# Altium project LPCB228__RLOOP__DC_CONVERTER.PrjPCB
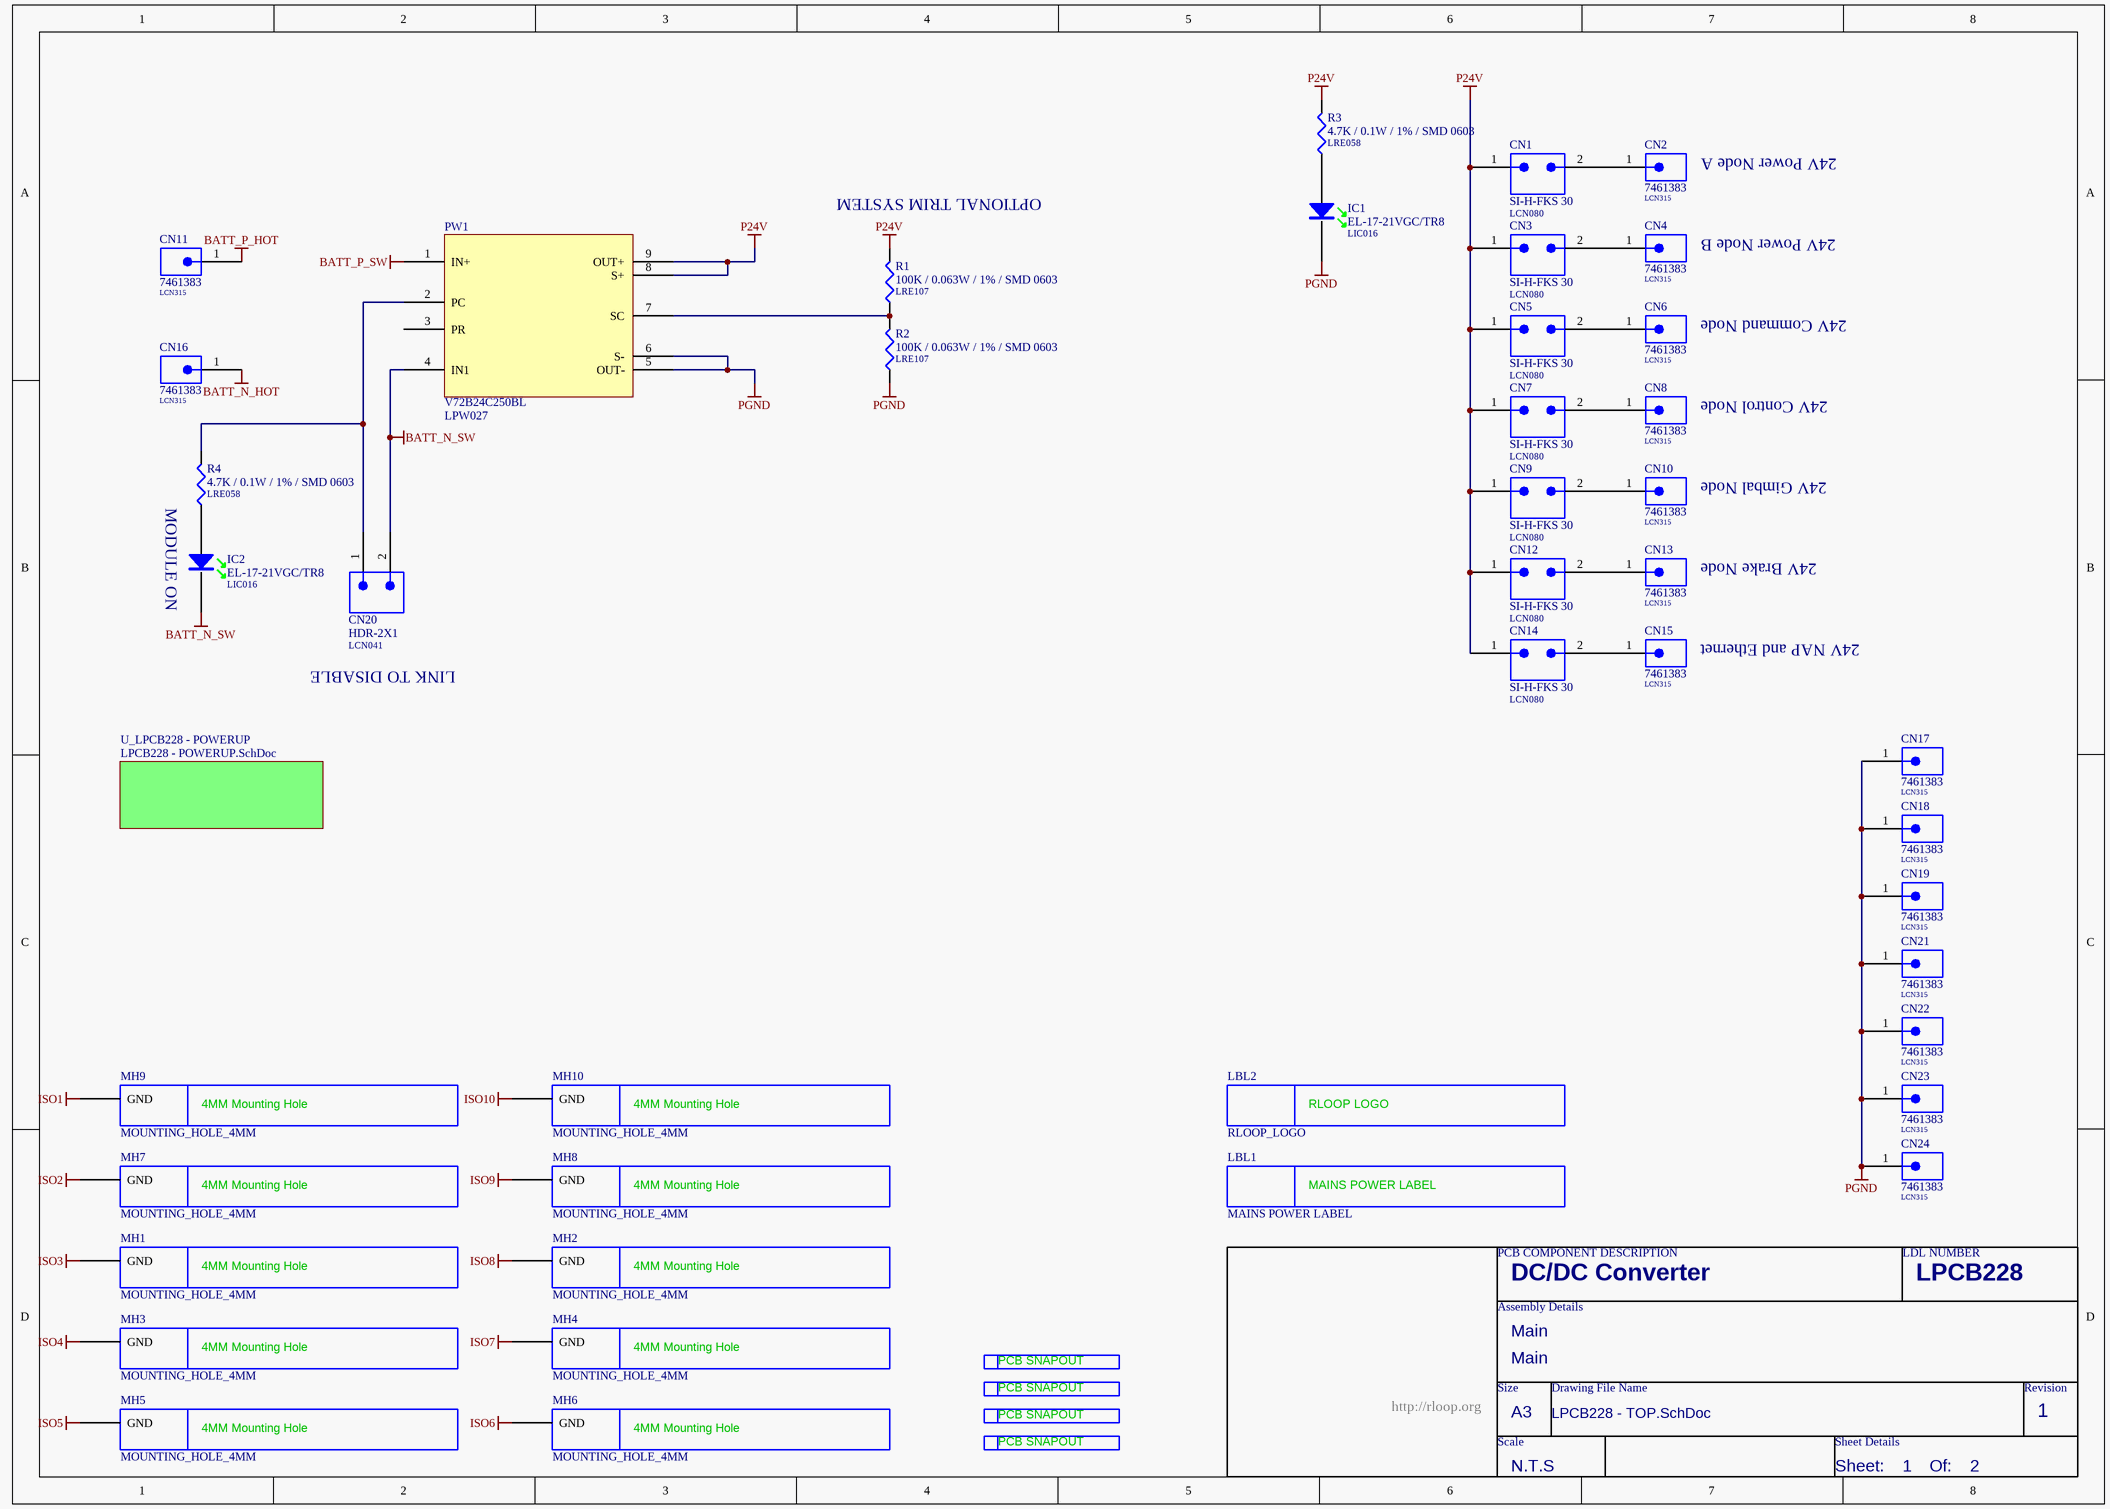
[diagram p0: LPCB228 - TOP.SchDoc]
2 sheets, 61 parts. Net scope: global (net labels, ports and power ports of the same name join across sheets).
Board files: LPCB228R0.PcbDoc, LPCB228R0__ASCII.PcbDoc
Sheets:
  LPCB228 - TOP.SchDoc
    U_LPCB228 - POWERUP = LPCB228 - POWERUP.SchDoc

## Sheet LPCB228 - TOP.SchDoc
size A3; Address1: Factory 10; Address2: 9-13 Dingley Avenue, Dandeong, VICTORIA 3175, AUSTRALIA; DocumentNumber: 1; Revision: 1; SheetNumber: 1; SheetTotal: 2; Lockie__PCB_SUB_ASSEMBLY: Main; Lockie__PCB_ASSEMBLY: Main; Lockie__LDL: LPCB228; Lockie__PCB_DESCRIPTION: DC/DC Converter

### Parts
CN1  SI-H-FKS 30  LDL_NUMBER: LCN080  [SI-H-FKS-30]
CN2  7461383  LDL_NUMBER: LCN315  [7461383]
CN3  SI-H-FKS 30  LDL_NUMBER: LCN080  [SI-H-FKS-30]
CN4  7461383  LDL_NUMBER: LCN315  [7461383]
CN5  SI-H-FKS 30  LDL_NUMBER: LCN080  [SI-H-FKS-30]
CN6  7461383  LDL_NUMBER: LCN315  [7461383]
CN7  SI-H-FKS 30  LDL_NUMBER: LCN080  [SI-H-FKS-30]
CN8  7461383  LDL_NUMBER: LCN315  [7461383]
CN9  SI-H-FKS 30  LDL_NUMBER: LCN080  [SI-H-FKS-30]
CN10  7461383  LDL_NUMBER: LCN315  [7461383]
CN11  7461383  LDL_NUMBER: LCN315  [7461383]
CN12  SI-H-FKS 30  LDL_NUMBER: LCN080  [SI-H-FKS-30]
CN13  7461383  LDL_NUMBER: LCN315  [7461383]
CN14  SI-H-FKS 30  LDL_NUMBER: LCN080  [SI-H-FKS-30]
CN15  7461383  LDL_NUMBER: LCN315  [7461383]
CN16  7461383  LDL_NUMBER: LCN315  [7461383]
CN17  7461383  LDL_NUMBER: LCN315  [7461383]
CN18  7461383  LDL_NUMBER: LCN315  [7461383]
CN19  7461383  LDL_NUMBER: LCN315  [7461383]
CN20  HDR-2X1  LDL_NUMBER: LCN041  [HDR-2X1]
CN21  7461383  LDL_NUMBER: LCN315  [7461383]
CN22  7461383  LDL_NUMBER: LCN315  [7461383]
CN23  7461383  LDL_NUMBER: LCN315  [7461383]
CN24  7461383  LDL_NUMBER: LCN315  [7461383]
IC1  EL-17-21VGC/TR8  LDL_NUMBER: LIC016  [CR2012-0805-LED]
IC2  EL-17-21VGC/TR8  LDL_NUMBER: LIC016  [CR2012-0805-LED]
LBL1  MAINS POWER LABEL  [MAINS POWER LABEL]  (no BOM)
LBL2  RLOOP_LOGO  [RLOOP_LOGO]  (no BOM)
MH1  MOUNTING_HOLE_4MM  [MOUNTING_HOLE_4MM]  (no BOM)
MH2  MOUNTING_HOLE_4MM  [MOUNTING_HOLE_4MM]  (no BOM)
MH3  MOUNTING_HOLE_4MM  [MOUNTING_HOLE_4MM]  (no BOM)
MH4  MOUNTING_HOLE_4MM  [MOUNTING_HOLE_4MM]  (no BOM)
MH5  MOUNTING_HOLE_4MM  [MOUNTING_HOLE_4MM]  (no BOM)
MH6  MOUNTING_HOLE_4MM  [MOUNTING_HOLE_4MM]  (no BOM)
MH7  MOUNTING_HOLE_4MM  [MOUNTING_HOLE_4MM]  (no BOM)
MH8  MOUNTING_HOLE_4MM  [MOUNTING_HOLE_4MM]  (no BOM)
MH9  MOUNTING_HOLE_4MM  [MOUNTING_HOLE_4MM]  (no BOM)
MH10  MOUNTING_HOLE_4MM  [MOUNTING_HOLE_4MM]  (no BOM)
PW1  V72B24C250BL  LDL_NUMBER: LPW027  [FASTRAK_MINI_ONBOARD_MOUNT]
R1  100K / 0.063W / 1% / SMD 0603  LDL_NUMBER: LRE107  [LFP020__CR1608-0603-IPC7351_B]
R2  100K / 0.063W / 1% / SMD 0603  LDL_NUMBER: LRE107  [LFP020__CR1608-0603-IPC7351_B]
R3  4.7K / 0.1W / 1% / SMD 0603  LDL_NUMBER: LRE058  [LFP020__CR1608-0603-IPC7351_B]
R4  4.7K / 0.1W / 1% / SMD 0603  LDL_NUMBER: LRE058  [LFP020__CR1608-0603-IPC7351_B]
SN1  PCB_SNAPOUT  [SNAPOUT_NEW]  (value not drawn)  (no BOM)
SN2  PCB_SNAPOUT  [SNAPOUT_NEW]  (value not drawn)  (no BOM)
SN3  PCB_SNAPOUT  [SNAPOUT_NEW]  (value not drawn)  (no BOM)
SN4  PCB_SNAPOUT  [SNAPOUT_NEW]  (value not drawn)  (no BOM)

### Sub-sheets
U_LPCB228 - POWERUP = LPCB228 - POWERUP.SchDoc: no entries

### Nets
BATT_N_HOT: CN16.1
BATT_N_SW: CN20.2 IC2.K PW1.4(IN1)
BATT_P_HOT: CN11.1
BATT_P_SW: PW1.1(IN+)
ISO1: MH9.MOUNT(GND)
ISO2: MH7.MOUNT(GND)
ISO3: MH1.MOUNT(GND)
ISO4: MH3.MOUNT(GND)
ISO5: MH5.MOUNT(GND)
ISO6: MH6.MOUNT(GND)
ISO7: MH4.MOUNT(GND)
ISO8: MH2.MOUNT(GND)
ISO9: MH8.MOUNT(GND)
ISO10: MH10.MOUNT(GND)
P24V: CN1.1 CN3.1 CN5.1 CN7.1 CN9.1 CN12.1 CN14.1 PW1.8(S+) PW1.9(OUT+) R1.2 R3.2
PGND: CN17.1 CN18.1 CN19.1 CN21.1 CN22.1 CN23.1 CN24.1 IC1.K PW1.5(OUT-) PW1.6(S-) R2.1
NetCN1_2: CN1.2 CN2.1
NetCN3_2: CN3.2 CN4.1
NetCN5_2: CN5.2 CN6.1
NetCN7_2: CN7.2 CN8.1
NetCN9_2: CN9.2 CN10.1
NetCN12_2: CN12.2 CN13.1
NetCN14_2: CN14.2 CN15.1
NetCN20_1: CN20.1 PW1.2(PC) R4.2
NetIC1_A: IC1.A R3.1
NetIC2_A: IC2.A R4.1
NetPW1_7: PW1.7(SC) R1.1 R2.2

Not connected (* = marked no-connect by the designer): PW1 3(PR)

### Notes on the sheet
- 24V Power Node A
- (near R1) OPTIONAL TRIM SYSTEM
- 24V Power Node B
- 24V Command Node
- 24V Control Node
- 24V Gimbal Node
- 24V Brake Node
- (near IC2) MODULE ON
- 24V NAP and Ethernet
- LINK TO DISABLE
- PCB COMPONENT DESCRIPTION
- LDL NUMBER
- Assembly Details
- Size
- Drawing File Name
- Revision
- http://rloop.org
- Scale
- A3
- Sheet Details
- N.T.S
- Sheet:
- Of:
- (in symbol MOUNTING_HOLE_4MM) 4MM Mounting Hole
- (in symbol PCB_SNAPOUT) PCB SNAPOUT
- (in symbol RLOOP_LOGO) RLOOP LOGO

### Library data of the parts
CN1 CN3 CN5 CN7 CN9 CN12 CN14 = SI-H-FKS 30: Connector, Blade Fuse Holder, 5mm Terminals, 30A Max, PTH; FMEDA__CHANNEL: COM; FMEDA__OPERATING__CURRENT_MAX: 0; FMEDA__OPERATING__TEMP_MAX: 50; FMEDA__OPERATING__TEMP_MIN: -20; FMEDA__OPERATING__TEMP_TYP: 27; FMEDA__OPERATING__VOLTAGE_MAX: 16; FMEDA__OPERATING__VOLTAGE_TYP: 12; FMEDA__FUNCTION_IN_SYSTEM: *; FMEDA__OPERATING__CURRENT_MIN: 0; FMEDA__OPERATING__CURRENT_TYP: 0; FMEDA__OPERATING__VOLTAGE_MIN: 0
CN2 CN4 CN6 CN8 CN10 CN11 CN13 CN15-CN19 CN21-CN24 = 7461383: Terminal, Bush with M5 Shank; FMEDA__CHANNEL: COM; FMEDA__OPERATING__CURRENT_MAX: 0; FMEDA__OPERATING__TEMP_MAX: 50; FMEDA__OPERATING__TEMP_MIN: -20; FMEDA__OPERATING__TEMP_TYP: 27; FMEDA__OPERATING__VOLTAGE_MAX: 16; FMEDA__OPERATING__VOLTAGE_TYP: 12; FMEDA__OPERATING__CURRENT_MIN: 0; FMEDA__OPERATING__CURRENT_TYP: 0; FMEDA__OPERATING__VOLTAGE_MIN: 0
CN20 = HDR-2X1: Header, 2.54mm (0.1in), 2 Pins x 1 Row (40 Per Row In Strip); FMEDA__CHANNEL: COM; FMEDA__OPERATING__CURRENT_MAX: 0; FMEDA__OPERATING__TEMP_MAX: 50; FMEDA__OPERATING__TEMP_MIN: -20; FMEDA__OPERATING__TEMP_TYP: 27; FMEDA__OPERATING__VOLTAGE_MAX: 16; FMEDA__OPERATING__VOLTAGE_TYP: 12; FMEDA__OPERATING__CURRENT_MIN: 0; FMEDA__OPERATING__CURRENT_TYP: 0; FMEDA__OPERATING__VOLTAGE_MIN: 0; FMEDA__FUNCTION_IN_SYSTEM: *
IC1 IC2 = EL-17-21VGC/TR8: LED, SMD, 0805 Green [LIC016]; FMEDA__OPERATING__TEMP_MAX: 50; FMEDA__OPERATING__TEMP_MIN: -20; FMEDA__OPERATING__TEMP_TYP: 27; FMEDA__CHANNEL: COM; FMEDA__FUNCTION_IN_SYSTEM: *
LBL1 = MAINS POWER LABEL: FMEDA__CHANNEL: DIAG; FMEDA__FUNCTION_IN_SYSTEM: *
LBL2 = RLOOP_LOGO: FMEDA__CHANNEL: DIAG; FMEDA__FUNCTION_IN_SYSTEM: *
MH1-MH10 = MOUNTING_HOLE_4MM: 4MM Mouting Hole; FMEDA__CHANNEL: DIAG; FMEDA__FUNCTION_IN_SYSTEM: *
PW1 = V72B24C250BL: DC-DC Converter, 43-110VIN, 24V, 10A
R1 R2 = 100K / 0.063W / 1% / SMD 0603: Resistor, Ceramic Chip, 100K0, 0.063W, 1%, SMD 0603 [LRE107]; FMEDA__OPERATING__POWER_MAX: 0; FMEDA__OPERATING__TEMP_MAX: 50; FMEDA__OPERATING__TEMP_MIN: -20; FMEDA__OPERATING__TEMP_TYP: 27; FMEDA__CHANNEL: COM; Value: 100K; FMEDA__OPERATING__POWER_MIN: 0; FMEDA__OPERATING__VOLTAGE_MAX: 0; FMEDA__OPERATING__VOLTAGE_MIN: 0; FMEDA__OPERATING__VOLTAGE_TYP: 0; FMEDA__FUNCTION_IN_SYSTEM: *
R3 R4 = 4.7K / 0.1W / 1% / SMD 0603: Resistor, Ceramic Chip, 4K7, 0.1W, 1%, SMD 0603 [LRE058]; FMEDA__OPERATING__POWER_MAX: 0; FMEDA__OPERATING__TEMP_MAX: 50; FMEDA__OPERATING__TEMP_MIN: -20; FMEDA__OPERATING__TEMP_TYP: 27; FMEDA__CHANNEL: COM; VALUE: 4.7K; FMEDA__OPERATING__POWER_MIN: 0; FMEDA__OPERATING__VOLTAGE_MAX: 0; FMEDA__OPERATING__VOLTAGE_MIN: 0; FMEDA__OPERATING__VOLTAGE_TYP: 0; FMEDA__FUNCTION_IN_SYSTEM: *
SN1-SN4 = PCB_SNAPOUT: FMEDA__CHANNEL: DIAG; FMEDA__FUNCTION_IN_SYSTEM: *

## Sheet LPCB228 - POWERUP.SchDoc
size A3; Address1: Factory 10; Address2: 9-13 Dingley Avenue, Dandeong, VICTORIA 3175, AUSTRALIA; DocumentNumber: 2; Revision: 1; SheetNumber: 2; SheetTotal: 2; Lockie__PCB_SUB_ASSEMBLY: Power / Ignitor; Lockie__PCB_ASSEMBLY: Main; Lockie__LDL: LPCB228; Lockie__PCB_DESCRIPTION: DC/DC Converter
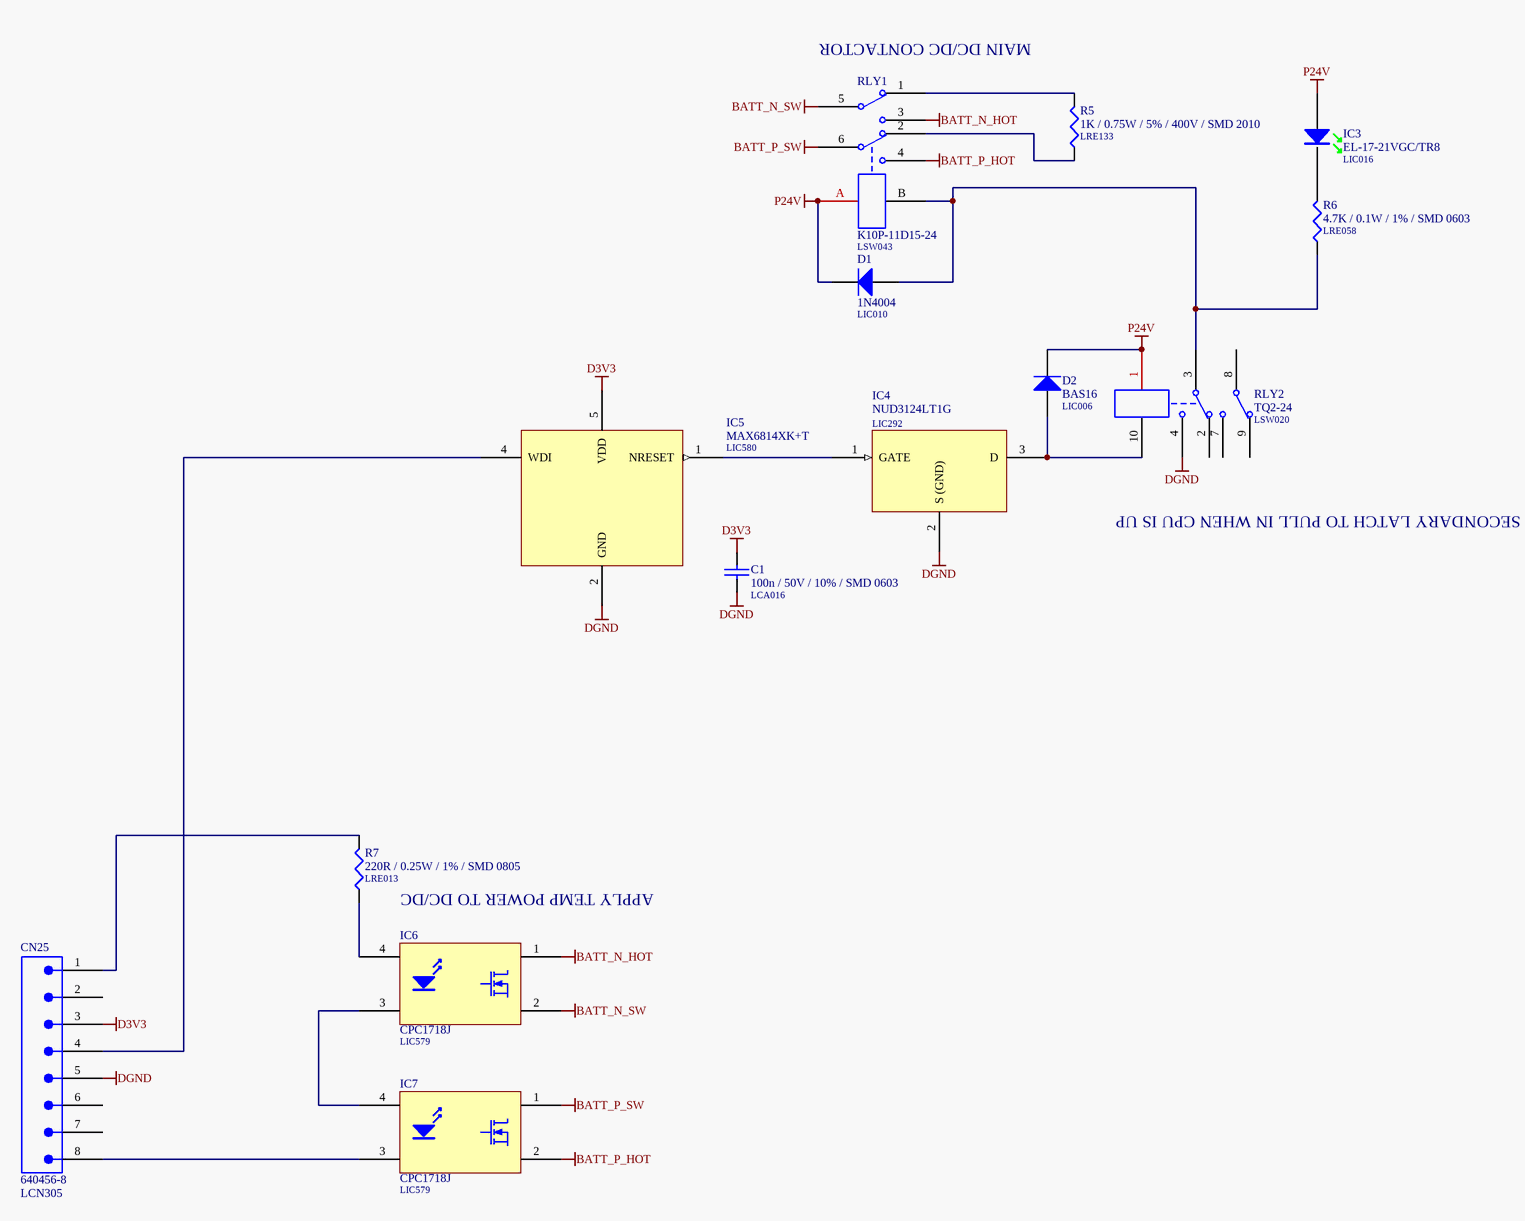
[diagram p1: LPCB228 - POWERUP.SchDoc]

### Parts
C1  100n / 50V / 10% / SMD 0603  LDL_NUMBER: LCA016  [LFP011__CC1608-0603-IPC7351_B]
CN25  640456-8  LDL_NUMBER: LCN305  [640456-8]
D1  1N4004  LDL_NUMBER: LIC010  [DO-41]
D2  BAS16  LDL_NUMBER: LIC006  [LFP021__SOT23]
IC3  EL-17-21VGC/TR8  LDL_NUMBER: LIC016  [CR2012-0805-LED]
IC4  NUD3124LT1G  LDL_NUMBER: LIC292  [LFP021__SOT23]
IC5  MAX6814XK+T  LDL_NUMBER: LIC580  [LFP047__SOT353]
IC6  CPC1718J  LDL_NUMBER: LIC579  [ISOPLUS-264]
IC7  CPC1718J  LDL_NUMBER: LIC579  [ISOPLUS-264]
R5  1K / 0.75W / 5% / 400V / SMD 2010  LDL_NUMBER: LRE133  [LFP060__CR5025-2010]
R6  4.7K / 0.1W / 1% / SMD 0603  LDL_NUMBER: LRE058  [LFP020__CR1608-0603-IPC7351_B]
R7  220R / 0.25W / 1% / SMD 0805  LDL_NUMBER: LRE013  [LFP029__CR2012-0805]
RLY1  K10P-11D15-24  LDL_NUMBER: LSW043  [K10P-11D15-24]
RLY2  TQ2-24  LDL_NUMBER: LSW020  [TQ2]

### Nets
BATT_N_HOT: IC6.1 RLY1.3
BATT_N_SW: IC6.2 RLY1.5
BATT_P_HOT: IC7.2 RLY1.4
BATT_P_SW: IC7.1 RLY1.6
D3V3: C1.1 CN25.3 IC5.5(VDD)
DGND: C1.2 CN25.5 IC4.2(S_(GND)) IC5.2(GND) RLY2.4
P24V: D1.K D2.3(K) IC3.A RLY1.A RLY2.1
NetCN25_1: CN25.1 R7.2
NetCN25_4: CN25.4 IC5.4(WDI)
NetCN25_8: CN25.8 IC7.3
NetD1_A: D1.A R6.1 RLY1.B RLY2.3
NetD2_1: D2.1(A) IC4.3(D) RLY2.10
NetIC3_K: IC3.K R6.2
NetIC4_1: IC4.1(GATE) IC5.1(NRESET)
NetIC6_3: IC6.3 IC7.4
NetIC6_4: IC6.4 R7.1
NetR5_1: R5.1 RLY1.2
NetR5_2: R5.2 RLY1.1

Not connected (* = marked no-connect by the designer): CN25 2 6 7; RLY2 2 7 8 9

### Notes on the sheet
- (near RLY1) MAIN DC/DC CONTACTOR
- SECONDARY LATCH TO PULL IN WHEN CPU IS UP
- APPLY TEMP POWER TO DC/DC
- PCB COMPONENT DESCRIPTION
- LDL NUMBER
- Assembly Details
- Size
- Drawing File Name
- Revision
- http://rloop.org
- Scale
- A3
- Sheet Details
- N.T.S
- Sheet:
- Of:

### Library data of the parts
C1 = 100n / 50V / 10% / SMD 0603: Capacitor, Ceramic Chip, 100nF (0.1uF), 50V, 5%, SMD 0603 [LCA016]; FMEDA__OPERATING__VOLTAGE_MIN: 0; FMEDA__OPERATING__VOLTAGE_MAX: 3.3; FMEDA__OPERATING__TEMP_MIN: -20; FMEDA__OPERATING__TEMP_TYP: 27; FMEDA__OPERATING__TEMP_MAX: 50; FMEDA__CHANNEL: COM; Value: 100n; FMEDA__FUNCTION_IN_SYSTEM: *; FMEDA__OPERATING__VOLTAGE_TYP: 3.3
CN25 = 640456-8: Connector, Male Header, 8 Way; FMEDA__CHANNEL: COM; FMEDA__OPERATING__CURRENT_MAX: 0; FMEDA__OPERATING__TEMP_MAX: 50; FMEDA__OPERATING__TEMP_MIN: -20; FMEDA__OPERATING__TEMP_TYP: 27; FMEDA__OPERATING__VOLTAGE_MAX: 16; FMEDA__OPERATING__VOLTAGE_TYP: 12; FMEDA__FUNCTION_IN_SYSTEM: *; FMEDA__OPERATING__CURRENT_MIN: 0; FMEDA__OPERATING__CURRENT_TYP: 0; FMEDA__OPERATING__VOLTAGE_MIN: 0
D1 = 1N4004: Diode, General Purpose Rectifier, 1A, PTH [LIC010]; FMEDA__OPERATING__TEMP_MAX: 50; FMEDA__OPERATING__TEMP_MIN: -20; FMEDA__OPERATING__TEMP_TYP: 27; FMEDA__OPERATING__VOLTAGE_MAX: 0; FMEDA__CHANNEL: COM; FMEDA__FUNCTION_IN_SYSTEM: *; FMEDA__OPERATING__VOLTAGE_MIN: 0; FMEDA__OPERATING__VOLTAGE_TYP: 0; FMEDA__OPERATING__CURRENT_MAX: 0; FMEDA__OPERATING__CURRENT_MIN: 0; FMEDA__OPERATING__CURRENT_TYP: 0
D2 = BAS16: Diode, Small Signal, 0.2A, 85V, SMD SOT-23 [LIC006]; FMEDA__OPERATING__CURRENT_MIN: 0; FMEDA__OPERATING__TEMP_MIN: -20; FMEDA__OPERATING__TEMP_TYP: 27; FMEDA__OPERATING__TEMP_MAX: 50; FMEDA__CHANNEL: COM; FMEDA__OPERATING__CURRENT_MAX: 0; FMEDA__OPERATING__VOLTAGE_MIN: 0; FMEDA__OPERATING__VOLTAGE_MAX: 0; FMEDA__FUNCTION_IN_SYSTEM: *; FMEDA__OPERATING__CURRENT_TYP: 0; FMEDA__OPERATING__VOLTAGE_TYP: 0
IC3 = EL-17-21VGC/TR8: as IC1 on sheet LPCB228 - TOP; FMEDA__FUNCTION_IN_SYSTEM: *
IC4 = NUD3124LT1G: IC, Relay Driver, 28V Industrial, SMD SOT23 [LIC292]; FMEDA__OPERATING__TEMP_MIN: -20; FMEDA__OPERATING__TEMP_TYP: 27; FMEDA__OPERATING__TEMP_MAX: 50; FMEDA__OPERATING__VOLTAGE_MIN: 0; FMEDA__OPERATING__VOLTAGE_TYP: 13; FMEDA__OPERATING__VOLTAGE_MAX: 18; FMEDA__OPERATING__POWER_TYP: 0.1; FMEDA__OPERATING__POWER_MAX: 0.15; FMEDA__CHANNEL: COM; FMEDA__FUNCTION_IN_SYSTEM: *; FMEDA__OPERATING__POWER_MIN: 0
IC5 = MAX6814XK+T: IC, Watchdog, SMD [LIC580]; FMEDA__OPERATING__TEMP_MIN: -20; FMEDA__OPERATING__TEMP_TYP: 27; FMEDA__OPERATING__TEMP_MAX: 50; FMEDA__OPERATING__VOLTAGE_MIN: 0; FMEDA__OPERATING__VOLTAGE_TYP: 3.3; FMEDA__CHANNEL: COM; FMEDA__FUNCTION_IN_SYSTEM: *; FMEDA__OPERATING__VOLTAGE_MAX: 3.3
IC6 IC7 = CPC1718J: IC, Solid State Relay, PTH [LIC579]; FMEDA__OPERATING__TEMP_MAX: 50; FMEDA__OPERATING__TEMP_MIN: -20; FMEDA__OPERATING__TEMP_TYP: 27; FMEDA__CHANNEL: COM; FMEDA__FUNCTION_IN_SYSTEM: *
R5 = 1K / 0.75W / 5% / 400V / SMD 2010: Resistor, Thick Film, 1K, 0.75W, 5%, 400V, SMD 2010 [LRE133]; FMEDA__OPERATING__POWER_MAX: 0; FMEDA__OPERATING__TEMP_MAX: 50; FMEDA__OPERATING__TEMP_MIN: -20; FMEDA__OPERATING__TEMP_TYP: 27; FMEDA__CHANNEL: COM; Value: 1K; FMEDA__OPERATING__POWER_MIN: 0; FMEDA__OPERATING__VOLTAGE_MAX: 0; FMEDA__OPERATING__VOLTAGE_MIN: 0; FMEDA__OPERATING__VOLTAGE_TYP: 0; FMEDA__FUNCTION_IN_SYSTEM: *
R6 = 4.7K / 0.1W / 1% / SMD 0603: as R3 on sheet LPCB228 - TOP; VALUE: 4.7K; FMEDA__OPERATING__POWER_MIN: 0; FMEDA__OPERATING__VOLTAGE_MAX: 0; FMEDA__OPERATING__VOLTAGE_MIN: 0; FMEDA__OPERATING__VOLTAGE_TYP: 0; FMEDA__FUNCTION_IN_SYSTEM: *
R7 = 220R / 0.25W / 1% / SMD 0805: Resistor, Ceramic Chip, 220R, 0.25W, 1%, SMD 0805 [LRE013]; Value: 220; FMEDA__OPERATING__POWER_MAX: 0; FMEDA__OPERATING__TEMP_MAX: 50; FMEDA__OPERATING__TEMP_MIN: -20; FMEDA__OPERATING__TEMP_TYP: 27; FMEDA__CHANNEL: COM; FMEDA__OPERATING__POWER_MIN: 0; FMEDA__OPERATING__VOLTAGE_MAX: 0; FMEDA__OPERATING__VOLTAGE_MIN: 0; FMEDA__OPERATING__VOLTAGE_TYP: 0; FMEDA__FUNCTION_IN_SYSTEM: *
RLY1 = K10P-11D15-24: Relay, DPDT, 24V, Socket Mount; FMEDA__OPERATING__TEMP_MAX: 50; FMEDA__OPERATING__TEMP_MIN: -20; FMEDA__OPERATING__TEMP_TYP: 27; FMEDA__CHANNEL: COM; Revision: July-2002: Re-released for DXP Platform.; FMEDA__FUNCTION_IN_SYSTEM: *
RLY2 = TQ2-24: Relay, DPDT, Non Latching, 24VDC Coil, 1A Rating, PTH; FMEDA__CHANNEL: COM; FMEDA__OPERATING__TEMP_MAX: 50; FMEDA__OPERATING__TEMP_MIN: -20; FMEDA__OPERATING__TEMP_TYP: 27; Revision: July-2002: Re-released for DXP Platform.

## Nets that join several sheets
BATT_N_HOT: LPCB228 - TOP (CN16.1), LPCB228 - POWERUP (IC6.1 RLY1.3)
BATT_N_SW: LPCB228 - TOP (CN20.2 IC2.K PW1.4), LPCB228 - POWERUP (IC6.2 RLY1.5)
BATT_P_HOT: LPCB228 - TOP (CN11.1), LPCB228 - POWERUP (IC7.2 RLY1.4)
BATT_P_SW: LPCB228 - TOP (PW1.1), LPCB228 - POWERUP (IC7.1 RLY1.6)
P24V: LPCB228 - TOP (11 pins), LPCB228 - POWERUP (5 pins)